# EAGLE design footswitch (EAGLE 9.0.1)
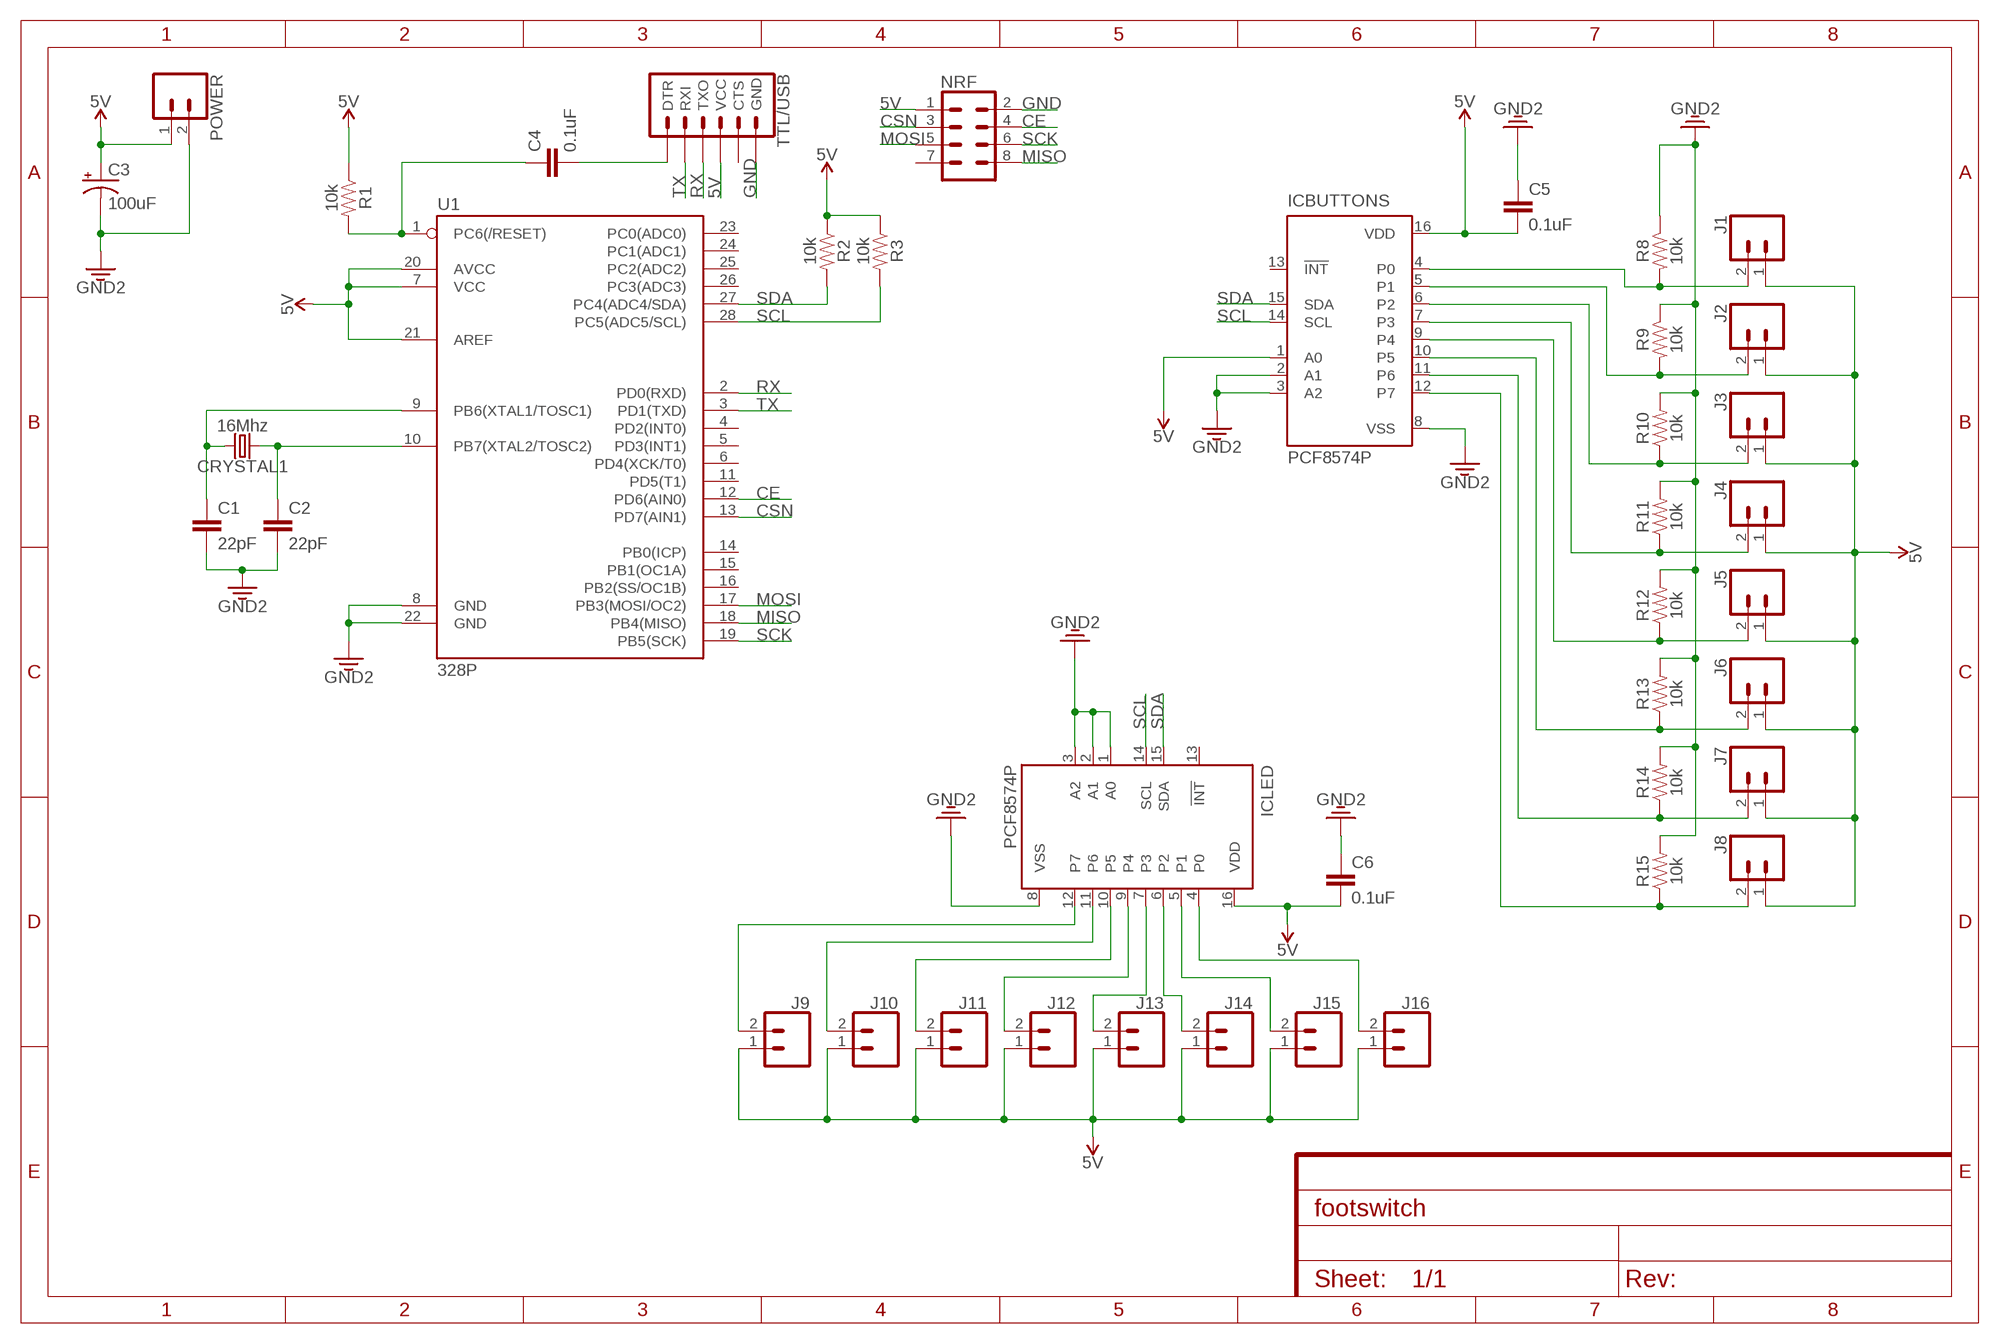
[diagram p0: schematic, sheet 1]

## Parts
C1  22pF  22PF-PTH-2.54MM-200V-5%  [CAP-PTH-2.54]
C2  22pF  22PF-PTH-2.54MM-200V-5%  [CAP-PTH-2.54]
C3  100uF  100UF-POLAR-RADIAL-2.5MM-25V-20%  [CPOL-RADIAL-2.5MM-6.5MM]
C4  0.1uF  0.1UF-KIT-EZ-50V-20%  [CAP-PTH-SMALL-KIT]
C5  0.1uF  0.1UF-KIT-EZ-50V-20%  [CAP-PTH-SMALL-KIT]
C6  0.1uF  0.1UF-KIT-EZ-50V-20%  [CAP-PTH-SMALL-KIT]
CRYSTAL1  16Mhz  CRYSTALPTH-HC49US  [HC49US]
ICBUTTONS  PCF8574P  [DIL16]
ICLED  PCF8574P  [DIL16]
J1  CONN_02POLAR  [MOLEX-1X2]
J2  CONN_02POLAR  [MOLEX-1X2]
J3  CONN_02POLAR  [MOLEX-1X2]
J4  CONN_02POLAR  [MOLEX-1X2]
J5  CONN_02POLAR  [MOLEX-1X2]
J6  CONN_02POLAR  [MOLEX-1X2]
J7  CONN_02POLAR  [MOLEX-1X2]
J8  CONN_02POLAR  [MOLEX-1X2]
J9  CONN_02POLAR  [MOLEX-1X2]
J10  CONN_02POLAR  [MOLEX-1X2]
J11  CONN_02POLAR  [MOLEX-1X2]
J12  CONN_02POLAR  [MOLEX-1X2]
J13  CONN_02POLAR  [MOLEX-1X2]
J14  CONN_02POLAR  [MOLEX-1X2]
J15  CONN_02POLAR  [MOLEX-1X2]
J16  CONN_02POLAR  [MOLEX-1X2]
NRF  CONN_04X2  [2X4]
POWER  CONN_02  [1X02]
R1  10k  10KOHM-HORIZ-1/4W-1%  [AXIAL-0.3]
R2  10k  10KOHM-HORIZ-1/4W-1%  [AXIAL-0.3]
R3  10k  10KOHM-HORIZ-1/4W-1%  [AXIAL-0.3]
R8  10k  10KOHM-HORIZ-1/4W-1%  [AXIAL-0.3]
R9  10k  10KOHM-HORIZ-1/4W-1%  [AXIAL-0.3]
R10  10k  10KOHM-HORIZ-1/4W-1%  [AXIAL-0.3]
R11  10k  10KOHM-HORIZ-1/4W-1%  [AXIAL-0.3]
R12  10k  10KOHM-HORIZ-1/4W-1%  [AXIAL-0.3]
R13  10k  10KOHM-HORIZ-1/4W-1%  [AXIAL-0.3]
R14  10k  10KOHM-HORIZ-1/4W-1%  [AXIAL-0.3]
R15  10k  10KOHM-HORIZ-1/4W-1%  [AXIAL-0.3]
TTL/USB  6_PIN_SERIAL_TARGETPTH-KIT  [1X06-KIT]
U1  328P  ATMEGA328P_PDIP  [DIP28]

## Nets
5V: C3.1(+) C5.2 C6.2 ICBUTTONS.1(A0) ICBUTTONS.16(VDD) ICLED.16(VDD) J1.1 J2.1 J3.1 J4.1 J5.1 J6.1 J7.1 J8.1 J9.1 J10.1 J11.1 J12.1 J13.1 J14.1 J15.1 J16.1 NRF.1 POWER.1 R1.P$1 R2.P$1 R3.P$1 TTL/USB.4(VCC) U1.7(VCC) U1.20(AVCC) U1.21(AREF)
CE: NRF.4 U1.12(PD6(AIN0))
CSN: NRF.3 U1.13(PD7(AIN1))
GND: C1.2 C2.2 C3.2(-) C5.1 C6.1 ICBUTTONS.2(A1) ICBUTTONS.3(A2) ICBUTTONS.8(VSS) ICLED.1(A0) ICLED.2(A1) ICLED.3(A2) ICLED.8(VSS) NRF.2 POWER.2 R8.P$1 R9.P$1 R10.P$2 R11.P$2 R12.P$2 R13.P$2 R14.P$2 R15.P$2 TTL/USB.6(GND) U1.8(GND) U1.22(GND) ; supply symbol labelled GND2
MISO: NRF.8 U1.18(PB4(MISO))
MOSI: NRF.5 U1.17(PB3(MOSI/OC2))
N$1: C4.1 R1.P$2 U1.1(PC6(/RESET))
N$2: C1.1 CRYSTAL1.2 U1.9(PB6(XTAL1/TOSC1))
N$3: C2.1 CRYSTAL1.1 U1.10(PB7(XTAL2/TOSC2))
N$4: C4.2 TTL/USB.1(DTR)
N$5: ICBUTTONS.4(P0) J1.2 R8.P$2
N$6: ICBUTTONS.5(P1) J2.2 R9.P$2
N$7: ICLED.7(P3) J13.2
N$8: ICBUTTONS.6(P2) J3.2 R10.P$1
N$9: ICBUTTONS.7(P3) J4.2 R11.P$1
N$10: ICBUTTONS.9(P4) J5.2 R12.P$1
N$11: ICBUTTONS.10(P5) J6.2 R13.P$1
N$12: ICBUTTONS.11(P6) J7.2 R14.P$1
N$13: ICBUTTONS.12(P7) J8.2 R15.P$1
N$14: ICLED.6(P2) J14.2
N$15: ICLED.12(P7) J9.2
N$16: ICLED.11(P6) J10.2
N$17: ICLED.10(P5) J11.2
N$18: ICLED.9(P4) J12.2
N$19: ICLED.5(P1) J15.2
N$20: ICLED.4(P0) J16.2
RX: TTL/USB.3(TXO) U1.2(PD0(RXD))
SCK: NRF.6 U1.19(PB5(SCK))
SCL: ICBUTTONS.14(SCL) ICLED.14(SCL) R3.P$2 U1.28(PC5(ADC5/SCL))
SDA: ICBUTTONS.15(SDA) ICLED.15(SDA) R2.P$2 U1.27(PC4(ADC4/SDA))
TX: TTL/USB.2(RXI) U1.3(PD1(TXD))
Unconnected: ICBUTTONS.13(!INT) ICLED.13(!INT) NRF.7 TTL/USB.5(CTS) U1.4(PD2(INT0)) U1.5(PD3(INT1)) U1.6(PD4(XCK/T0)) U1.11(PD5(T1)) U1.14(PB0(ICP)) U1.15(PB1(OC1A)) U1.16(PB2(SS/OC1B)) U1.23(PC0(ADC0)) U1.24(PC1(ADC1)) U1.25(PC2(ADC2)) U1.26(PC3(ADC3))

## Library data of the parts
C1 C2 = SparkFun-Capacitors:22PF: 22pF ceramic capacitors A capacitor is a passive two-terminal electrical component used to store electrical energy temporarily in an electric field.; PROD_ID: CAP-09128
C3 = SparkFun-Capacitors:100UF-POLAR: 100µF polarized capacitors A capacitor is a passive two-terminal electrical component used to store electrical energy temporarily in an electric field.; PROD_ID: CAP-08439
C4-C6 = SparkFun-Capacitors:0.1UF: 0.1µF ceramic capacitors A capacitor is a passive two-terminal electrical component used to store electrical energy temporarily in an electric field.; PROD_ID: CAP-08370
CRYSTAL1 = SparkFun-Clocks:CRYSTAL: Crystals (Generic) These are passive quartz crystals, which can be used as a clock source for a microcontroller. Crystal's are two-terminal devices. They require external "load" capacitors to generate an oscillating signal.
ICBUTTONS ICLED = micro-philips:PCF8574: I2C-Bus Remote 8-bit I/O expander http://www.semiconductors.philips.com/acrobat_download/datasheets/PCF8574_4.pdf; MPN: PCF8574PN; OC_FARNELL: 204020; OC_NEWARK: 11N8515
J1-J16 = SparkFun-Connectors:CONN_02: Multi connection point. Often used as Generic Header-pin footprint for 0.1 inch spaced/style header connections On any of the 0.1 inch spaced packages, you can populate with these: Break Away Headers - Straight <https://www.sparkfun.com/products/116> (PRT-00116) Break Away Male Headers - Right Angle <https://www.sparkfun.com/products/553> (PRT-00553) Female Headers <https://www.sparkfun.com/products/115> (PRT-00115) Break Away Headers - Machine Pin <https://www.sparkfun.com/products/117> (PRT-00117) Break Away Female Headers - Swiss Machine Pin <https://www.sparkfun.com/products/743> (PRT-00743) For SCREWTERMINALS and SPRING TERMINALS visit here: Screw Terimnals on SparkFun.com <https://www.sparkfun.com/search/results?term=Screw+Terminals> (5mm/3.5mm/2.54mm spacing) This device is also useful as a general connection point to wire up your design to another part of your project. Our various solder wires solder well into these plated through hole pads. Hook-Up Wire - Assortment (Stranded, 22 AWG) <https://www.sparkfun.com/products/11375> (PRT-11375) Hook-Up Wire - Assortment (Solid Core, 22 AWG) <https://www.sparkfun.com/products/11367> (PRT-11367) View the entire wire category on our website here <https://www.sparkfun.com/categories/141> Special notes: Molex polarized connector foot print use with: PRT-08233 with associated crimp pins and housings. 2.54_SCREWTERM for use with PRT-10571. 3.5mm Screw Terminal footprints for PRT-08084 5mm Screw Terminal footprints for use with PRT-08432; SF_ID: PRT-09918
NRF = SparkFun-Connectors:CONN_04X2: Multi connection point. Often used as Generic Header-pin footprint for 0.1 inch spaced/style header connections On any of the 0.1 inch spaced packages, you can populate with these: Break Away Headers - Straight <https://www.sparkfun.com/products/116> (PRT-00116) Break Away Male Headers - Right Angle <https://www.sparkfun.com/products/553> (PRT-00553) Female Headers <https://www.sparkfun.com/products/115> (PRT-00115) Break Away Headers - Machine Pin <https://www.sparkfun.com/products/117> (PRT-00117) Break Away Female Headers - Swiss Machine Pin <https://www.sparkfun.com/products/743> (PRT-00743)
POWER = SparkFun-Connectors:CONN_02: Multi connection point. Often used as Generic Header-pin footprint for 0.1 inch spaced/style header connections On any of the 0.1 inch spaced packages, you can populate with these: Break Away Headers - Straight <https://www.sparkfun.com/products/116> (PRT-00116) Break Away Male Headers - Right Angle <https://www.sparkfun.com/products/553> (PRT-00553) Female Headers <https://www.sparkfun.com/products/115> (PRT-00115) Break Away Headers - Machine Pin <https://www.sparkfun.com/products/117> (PRT-00117) Break Away Female Headers - Swiss Machine Pin <https://www.sparkfun.com/products/743> (PRT-00743) For SCREWTERMINALS and SPRING TERMINALS visit here: Screw Terimnals on SparkFun.com <https://www.sparkfun.com/search/results?term=Screw+Terminals> (5mm/3.5mm/2.54mm spacing) This device is also useful as a general connection point to wire up your design to another part of your project. Our various solder wires solder well into these plated through hole pads. Hook-Up Wire - Assortment (Stranded, 22 AWG) <https://www.sparkfun.com/products/11375> (PRT-11375) Hook-Up Wire - Assortment (Solid Core, 22 AWG) <https://www.sparkfun.com/products/11367> (PRT-11367) View the entire wire category on our website here <https://www.sparkfun.com/categories/141> Special notes: Molex polarized connector foot print use with: PRT-08233 with associated crimp pins and housings. 2.54_SCREWTERM for use with PRT-10571. 3.5mm Screw Terminal footprints for PRT-08084 5mm Screw Terminal footprints for use with PRT-08432
R1-R3 R8-R15 = SparkFun-Resistors:10KOHM: 10kΩ resistor A resistor is a passive two-terminal electrical component that implements electrical resistance as a circuit element. Resistors act to reduce current flow, and, at the same time, act to lower voltage levels within circuits. - Wikipedia; PROD_ID: RES-12183
TTL/USB = SparkFun-Connectors:6_PIN_SERIAL_TARGET: 6-pin header connection for use with the "FTDI BASIC" pinout - TARGET SIDE. Also known as "Arduino Serial Program Header". It is used to mate with our FTDI Basic serial programmers using the Arduino IDE. Note, this device has "TARGET" in the name. It is intended to be used on a design that contains a target micro-controller that you wish to program. The "sister" device, named "CABLE" is inteneded to be used on a design that usually lives on the end of your USB cable and prvides the converter chip (FTDI232 or FTDI231x) to commnicate serial RX/TX. You can populate with some of these: Break Away Headers - Straight <https://www.sparkfun.com/products/116> (PRT-00116) For reference (or to suit your programming needs) check out these designs: SparkFun FTDI Basic Breakout - 5V <https://www.sparkfun.com/products/9716> (DEV-09716) SparkFun FTDI Basic Breakout - 3.3V <https://www.sparkfun.com/products/9873> (DEV-09873) SparkFun FTDI SmartBasic <https://www.sparkfun.com/products/12935> (DEV-12935) SparkFun Beefy 3 - FTDI Basic Breakout <https://www.sparkfun.com/products/13746> (DEV-13746)
U1 = SparkFun-IC-Microcontroller:ATMEGA328P_PDIP: Atmel 328P Through hole ATMEGA328P uC used in the Arduino 32kb flash, 1k EEPROM, 2k SRAM Datasheet <http://www.sparkfun.com/datasheets/Components/SMD/ATMega328.pdf> SparkFun Products Storefront component: AVR 28 Pin 20MHz 32K 6A/D - ATMega328P <https://www.sparkfun.com/products/9061> (COM-09061) SparkFun Simon Says - Through-Hole Soldering Kit <https://www.sparkfun.com/products/10547> (KIT-10547) SparkFun Learn to Solder - Simon Says <https://www.sparkfun.com/products/13708> (KIT-13708) SparkFun BigTime Watch Kit <https://www.sparkfun.com/products/11734> (KIT-11734) SparkFun ClockIt <https://www.sparkfun.com/products/10930> (KIT-10930) SparkFun Serial Enabled LCD Kit <https://www.sparkfun.com/products/10097> (LCD-10097) SparkFun Simon Tilts - Through Hole Soldering Kit <https://www.sparkfun.com/products/12634> (KIT-12634) SparkFun Frequency Counter Kit <https://www.sparkfun.com/products/10140> (KIT-10140) FabFM Radio Kit <https://www.sparkfun.com/products/11043> (KIT-11043) SparkFun Binary Blaster Kit <https://www.sparkfun.com/products/12037> (KIT-12037) SparkFun Metro-Gnome <https://www.sparkfun.com/products/9236> (KIT-09236) ATmega328 with Arduino Optiboot (Uno) <https://www.sparkfun.com/products/10524> (DEV-10524); PROD_ID: IC-09136

## Board
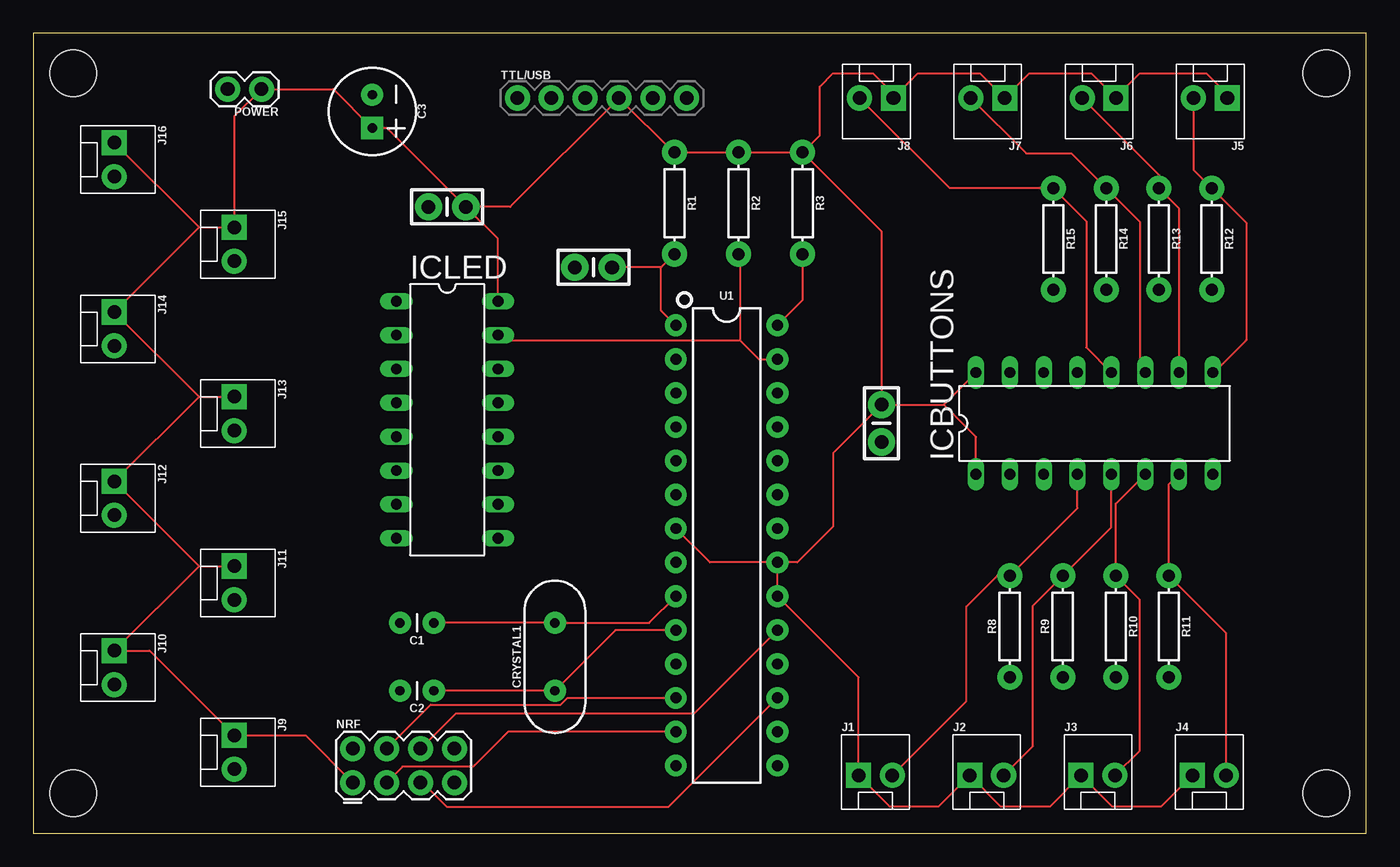
[diagram p1: board, top side]
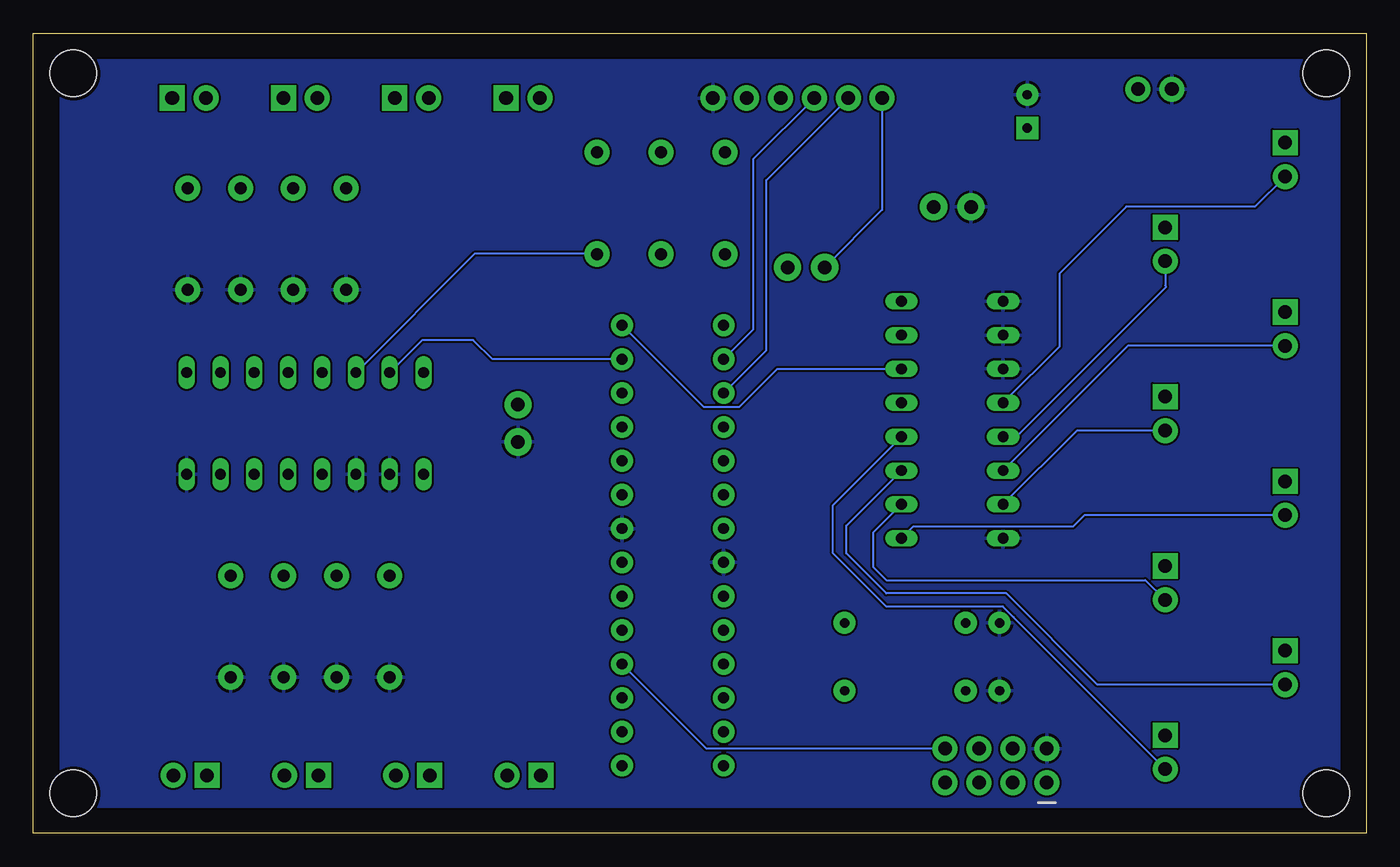
[diagram p2: board, bottom side, seen from below]

Size 100 x 60 mm. Coordinates in mm from the lower left corner, seen from the top.
Outline: 0,0 100,0 100,60 0,60 0,0
Copper layers (1*16): Top 0.018mm / dielectric 1.55mm / Bottom 0.018mm
Design rules "eC_2Layer_PClass6_BaseCopperO18_eCDefault": minimum track width 0.15mm, minimum drill 0.35mm, track to track 0.15mm, track to pad 0.15mm, pad to pad 0.15mm, via to via 0.15mm, smd to smd 0mil, copper to edge 0.25mm, drill to drill 0.35mm, minimum pad ring 0.175mm, minimum via ring 0.125mm, stop-mask expansion 0mil, vias tented up to drill 0.45mm, thermal gap 0.2mm
Holes 3.5 mm at 97,57 97,3 3,3 3,57

### Footprints (pad centres in the part's own frame; a part is rotated, then mirrored left to right if it is on the bottom)
CAP-PTH-2.54 = drill 0.7 pad 1.651: 1 -1.27,0; 2 1.27,0
CPOL-RADIAL-2.5MM-6.5MM = drill 0.7 pad 1.651 square: 1 1.25,0 | drill 0.7 pad 1.651: 2 -1.25,0
CAP-PTH-SMALL-KIT = drill 1.016 pad 2.032: 1 -1.397,0; 2 1.397,0
HC49US = drill 0.7 pad 1.651: 1 -2.54,0; 2 2.54,0
DIL16 = drill 0.813 long: 1 -8.89,-3.81; 2 -6.35,-3.81; 3 -3.81,-3.81; 4 -1.27,-3.81; 5 1.27,-3.81; 6 3.81,-3.81; 7 6.35,-3.81; 8 8.89,-3.81; 9 8.89,3.81; 10 6.35,3.81; 11 3.81,3.81; 12 1.27,3.81; 13 -1.27,3.81; 14 -3.81,3.81; 15 -6.35,3.81; 16 -8.89,3.81
MOLEX-1X2 = drill 1.016 pad 1.88 square: 1 0,0 | drill 1.016 pad 1.88: 2 2.54,0
2X4 = drill 1.016 pad 1.88: 1 -3.81,-1.27; 2 -3.81,1.27; 3 -1.27,-1.27; 4 -1.27,1.27; 5 1.27,-1.27; 6 1.27,1.27; 7 3.81,-1.27; 8 3.81,1.27
1X02 = drill 1.016 pad 1.88: 1 0,0; 2 2.54,0
AXIAL-0.3 = drill 0.9 pad 1.88: P$1 -3.81,0; P$2 3.81,0
1X06-KIT = drill 1.016 pad 1.88: 1 0,0; 2 2.54,0; 3 5.08,0; 4 7.62,0; 5 10.16,0; 6 12.7,0
DIP28 = drill 0.813 pad 1.626: 1 -16.51,-3.81; 2 -13.97,-3.81; 3 -11.43,-3.81; 4 -8.89,-3.81; 5 -6.35,-3.81; 6 -3.81,-3.81; 7 -1.27,-3.81; 8 1.27,-3.81; 9 3.81,-3.81; 10 6.35,-3.81; 11 8.89,-3.81; 12 11.43,-3.81; 13 13.97,-3.81; 14 16.51,-3.81; 15 16.51,3.81; 16 13.97,3.81; 17 11.43,3.81; 18 8.89,3.81; 19 6.35,3.81; 20 3.81,3.81; 21 1.27,3.81; 22 -1.27,3.81; 23 -3.81,3.81; 24 -6.35,3.81; 25 -8.89,3.81; 26 -11.43,3.81; 27 -13.97,3.81; 28 -16.51,3.81

### Placement (x,y rotation side)
C1  28.78,15.78 180 top
C2  28.78,10.7 180 top
C3  25.43,54.15 270 top
C4  42.02,42.45 180 top
C5  63.64,30.75 90 top
C6  31.05,46.99 0 top
CRYSTAL1  39.13,13.24 90 top
ICBUTTONS  79.61,30.75 0 top
ICLED  31.05,31.02 270 top
J1  61.91,4.35 0 top
J2  70.26,4.35 0 top
J3  78.61,4.35 0 top
J4  86.96,4.35 0 top
J5  89.58,55.15 180 top
J6  81.23,55.15 180 top
J7  72.88,55.15 180 top
J8  64.53,55.15 180 top
J9  15.08,7.35 270 top
J10  6.08,13.7 270 top
J11  15.08,20.05 270 top
J12  6.08,26.4 270 top
J13  15.08,32.75 270 top
J14  6.08,39.1 270 top
J15  15.08,45.45 270 top
J16  6.08,51.8 270 top
NRF  27.78,5.08 0 top
POWER  17.12,55.81 180 top
R1  48.1,47.26 270 top
R2  52.91,47.26 270 top
R3  57.72,47.26 270 top
R8  73.26,15.51 90 top
R9  77.24,15.51 90 top
R10  81.21,15.51 270 top
R11  85.19,15.51 270 top
R12  88.41,44.58 270 top
R13  84.45,44.58 270 top
R14  80.49,44.58 270 top
R15  76.53,44.58 270 top
TTL/USB  36.32,55.15 0 top
U1  52.02,21.59 270 top

### Tracks (layer width: path | path; a pad name or v marks a point on that pad's centre or on a via)
5V
  Top 0.152: J16.1 12.43,45.45 | 12.43,45.45 J15.1 15.08,53.77 POWER.1 22.52,55.81 C3.1 26.54,52.9 C6.2 | 12.43,45.45 J14.1 12.43,32.75 | 12.43,32.75 J13.1 | 12.43,32.75 J12.1 12.43,20.05 | 12.43,20.05 J11.1 | 12.43,20.05 J10.1 8.73,13.7 J9.1 20.43,7.35 NRF.1 | C6.2 35.78,46.99 TTL/USB.4 48.02,51.07 R1.P$1 R2.P$1 R3.P$1 | ICLED.16 34.86,44.58 C6.2 | J5.1 89.58,55.42 88,57 83,57 81.23,55.23 J6.1 79.38,57 74.73,57 J7.1 71.03,57 66.38,57 J8.1 64.53,55.47 63,57 60,57 59,56 59,52.35 R3.P$1 | J4.1 84.61,2 80.96,2 J3.1 76.26,2 72.61,2 J2.1 67.91,2 64.26,2 J1.1 61.91,11.7 U1.20 U1.21 | U1.21 50.75,20.32 U1.7 | C5.2 60,28.51 60,23 57.32,20.32 U1.21 | C5.2 68.31,32.15 | 68.31,32.15 ICBUTTONS.16 | ICBUTTONS.1 70.72,29.73 68.31,32.15 | R3.P$1 63.64,45.15 C5.2
CE
  Top 0.152: NRF.4 29.81,9.65 39.57,9.65 40.08,10.16 U1.12
CSN
  Top 0.152: U1.13 35.62,7.62 33,5 27.7,5 NRF.3
GND
  pour Bottom: 2,58 98,58 98,2 2,2
MISO
  Bottom 0.152: NRF.8 49.48,6.35 U1.18
MOSI
  Top 0.152: NRF.5 29.19,3.81 31,2 47.67,2 U1.17
N$1
  Top 0.152: R1.P$2 47.1,42.45 | 47.1,42.45 C4.1 | U1.1 47.1,39.21 47.1,42.45
N$2
  Top 0.152: C1.1 CRYSTAL1.2 46.21,15.78 U1.9
N$3
  Top 0.152: C2.1 CRYSTAL1.1 43.67,15.24 U1.10
N$4
  Bottom 0.152: TTL/USB.1 36.32,46.75 C4.2
N$5
  Top 0.152: J1.2 70,9.9 70,17 72.32,19.32 R8.P$2 78.34,24.4 ICBUTTONS.4
N$6
  Top 0.152: J2.2 75,6.55 75,17.08 R9.P$2 80.88,22.96 ICBUTTONS.5
N$7
  Bottom 0.152: J13.2 21.7,30.21 ICLED.7
N$8
  Top 0.152: J3.2 83,6.2 83,17.53 R10.P$1 81.21,24.73 ICBUTTONS.6
N$9
  Top 0.152: J4.2 89.5,15.01 R11.P$1 85.19,26.17 ICBUTTONS.7
N$10
  Top 0.152: J5.2 87.04,49.76 R12.P$1 91,45.8 91,37 88.56,34.56 ICBUTTONS.9
N$11
  Top 0.152: J6.2 84.45,49.39 R13.P$1 85.96,46.88 ICBUTTONS.10
N$12
  Top 0.152: J7.2 74.49,51 77.88,51 R14.P$1 83,45.88 83,34.98 ICBUTTONS.11
N$13
  Top 0.152: J8.2 68.75,48.39 R15.P$1 79,45.92 79,36.44 ICBUTTONS.12
N$14
  Bottom 0.152: J14.2 17.89,36.56 ICLED.6
N$15
  Bottom 0.152: J9.2 26.46,16.19 26.46,16.22 27.24,17 36,17 40,21 40,24.61 ICLED.12
N$16
  Bottom 0.152: J10.2 20.16,11.16 27,18 36,18 39,21 39,23.07 ICLED.11
N$17
  Bottom 0.152: ICLED.10 37,22.53 37,20 36,19 16.57,19 J11.2
N$18
  Bottom 0.152: J12.2 21.14,23.86 22,23 33.99,23 ICLED.9
N$19
  Bottom 0.152: J15.2 15.08,41.08 15,41 26.25,29.75 ICLED.5
N$20
  Bottom 0.152: J16.2 8.34,47 18,47 23,42 23,36.53 ICLED.4
RX
  Bottom 0.152: TTL/USB.3 46,50.55 46,37.77 U1.2
SCK
  Top 0.152: NRF.6 31.7,9 49.59,9 U1.19
SCL
  Top 0.152: R3.P$2 57.72,39.99 U1.28
  Bottom 0.152: R3.P$2 66.91,43.45 ICBUTTONS.14 | ICLED.14 44.17,34.83 47.02,31.98 49.71,31.98 U1.28
SDA
  Top 0.152: R2.P$2 53,43.36 53,37 | 53,37 54.44,35.56 U1.27 | ICLED.15 35.23,37 53,37
  Bottom 0.152: U1.27 65.56,35.56 67,37 70.82,37 ICBUTTONS.15
TX
  Bottom 0.152: U1.3 45,36.23 45,49 TTL/USB.2